# EAGLE schematic video_test (EAGLE 6.6.0)
Assembly variants: Minimal, Normal

## Sheet 1 of 4
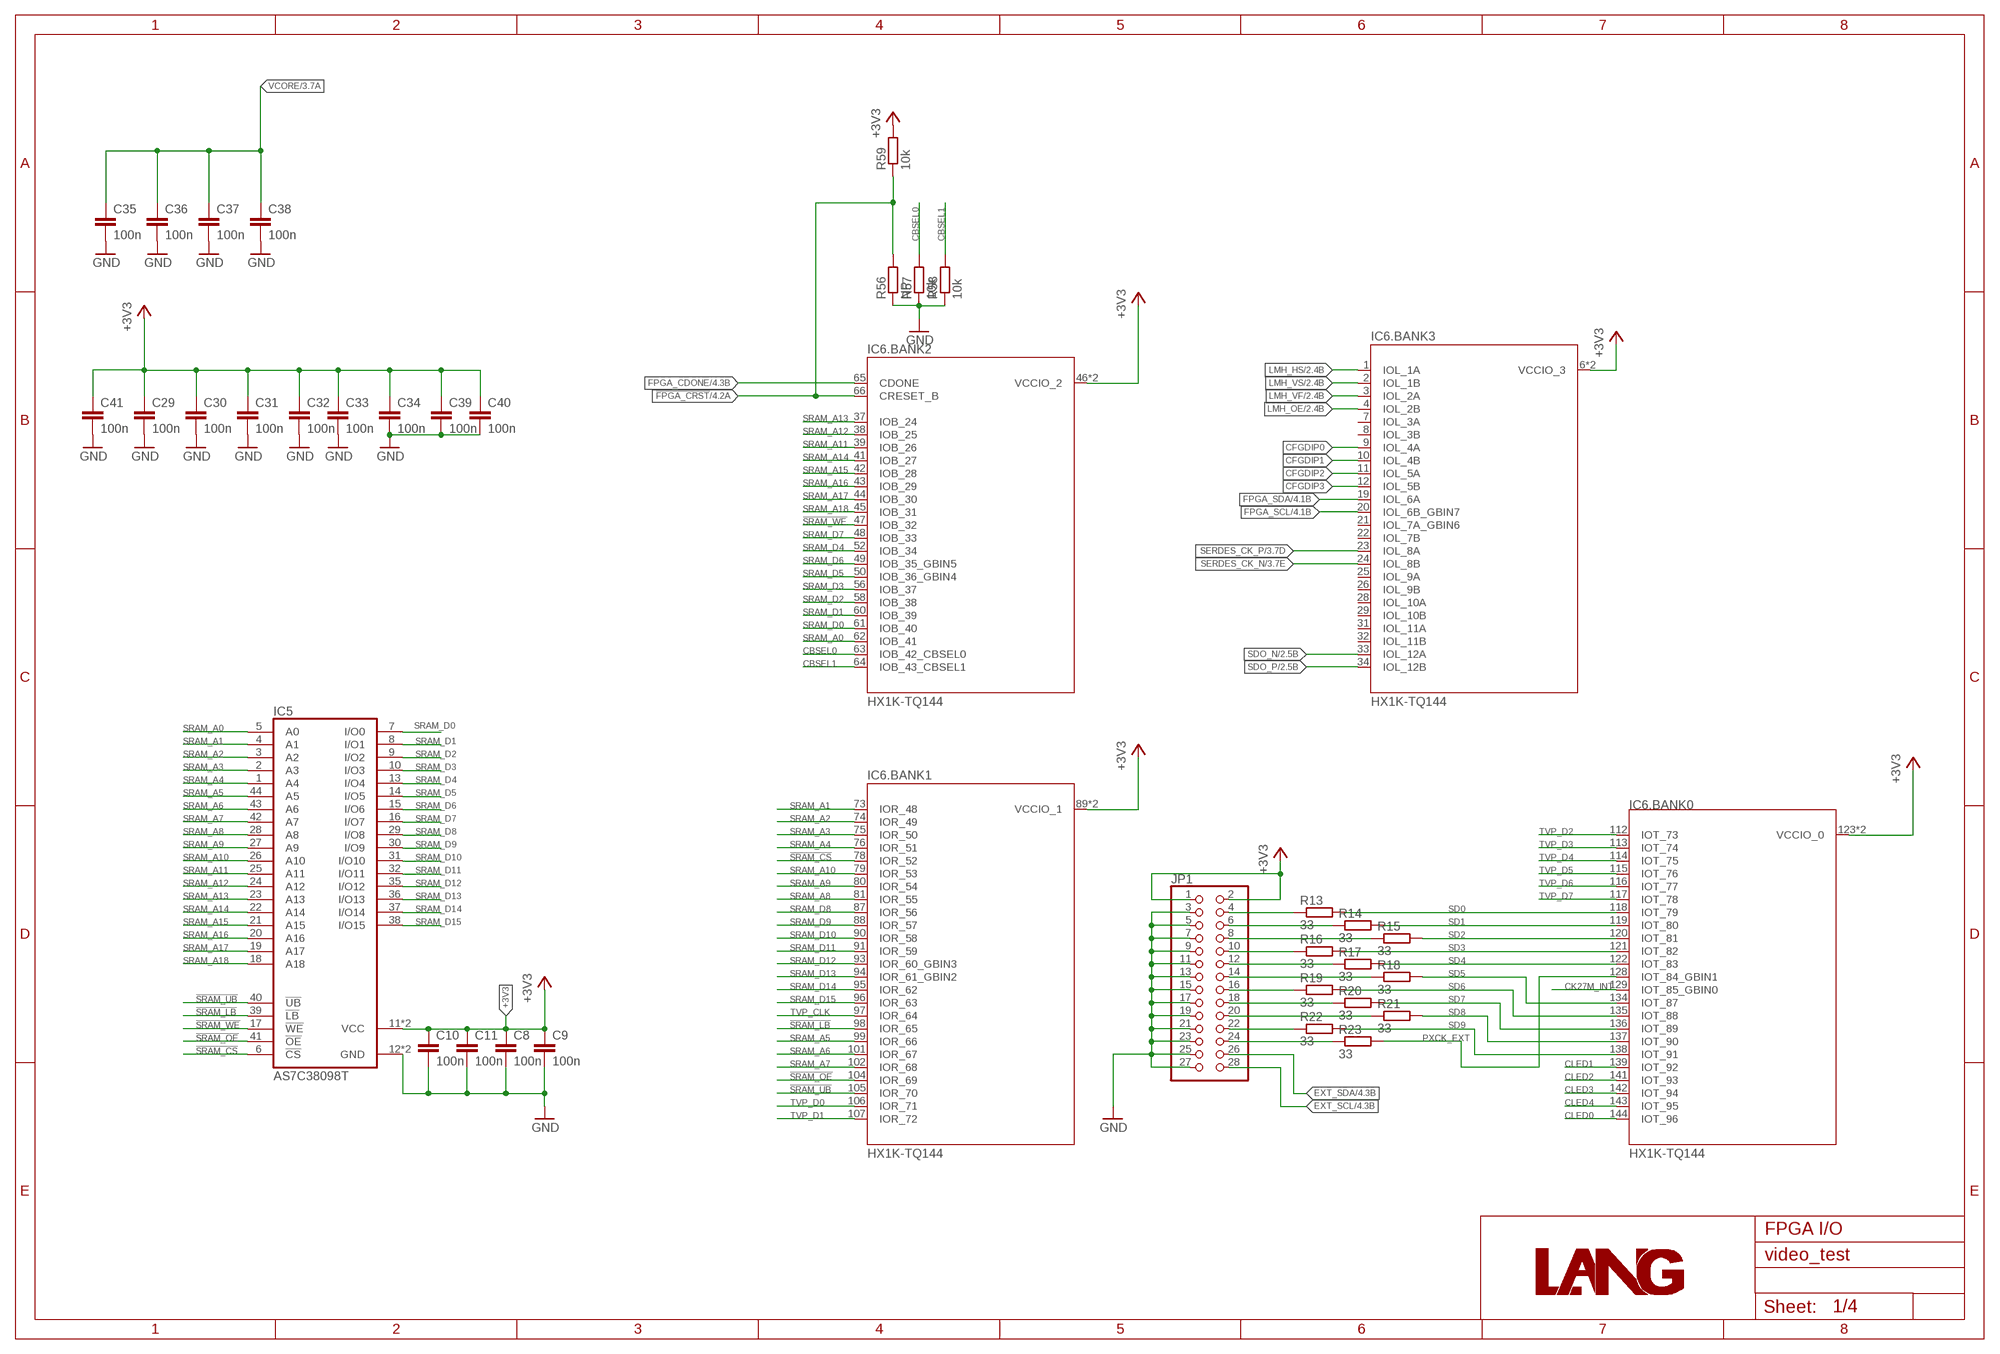
[diagram p0: schematic, sheet 1]
FRAME1 (A3L-LOC): PAGE_TITLE: FPGA I/O

### Parts
C8  100n  C-EUC0603  [C0603]  (not fitted in variant Minimal)
C9  100n  C-EUC0603  [C0603]  (not fitted in variant Minimal)
C10  100n  C-EUC0402  [C0402]  (not fitted in variant Minimal)
C11  100n  C-EUC0402  [C0402]  (not fitted in variant Minimal)
C29  100n  C-EUC0402  [C0402]
C30  100n  C-EUC0402  [C0402]
C31  100n  C-EUC0402  [C0402]
C32  100n  C-EUC0402  [C0402]
C33  100n  C-EUC0402  [C0402]
C34  100n  C-EUC0402  [C0402]
C35  100n  C-EUC0402  [C0402]
C36  100n  C-EUC0402  [C0402]
C37  100n  C-EUC0402  [C0402]
C38  100n  C-EUC0402  [C0402]
C39  100n  C-EUC0402  [C0402]
C40  100n  C-EUC0402  [C0402]
C41  100n  C-EUC0402  [C0402]
IC5  AS7C38098T  [TSOPII-Z44]  (not fitted in variant Minimal)
IC6  HX1K-TQ144  [QFP50P2200X2200X160-144N]
JP1  PINHD-2X14  [2X14]
R13  33  R-EU_R0603  [R0603]
R14  33  R-EU_R0603  [R0603]
R15  33  R-EU_R0603  [R0603]
R16  33  R-EU_R0603  [R0603]
R17  33  R-EU_R0603  [R0603]
R18  33  R-EU_R0603  [R0603]
R19  33  R-EU_R0603  [R0603]
R20  33  R-EU_R0603  [R0603]
R21  33  R-EU_R0603  [R0603]
R22  33  R-EU_R0603  [R0603]
R23  33  R-EU_R0603  [R0603]
R56  NP  R-EU_R0402  [R0402]
R57  10k  R-EU_R0402  [R0402]
R58  10k  R-EU_R0402  [R0402]
R59  10k  R-EU_R0402  [R0402]

### Nets
!FPGA_CRST!: IC6.66(.BANK2:CRESET_B) R56.2 R59.1 ; also sheet 4
!SRAM_CS!: IC5.6(!CS!) IC6.78(.BANK1:IOR_52)
!SRAM_LB!: IC5.39(!LB!) IC6.98(.BANK1:IOR_65)
!SRAM_OE!: IC5.41(!OE!) IC6.104(.BANK1:IOR_69)
!SRAM_UB!: IC5.40(!UB!) IC6.105(.BANK1:IOR_70)
!SRAM_WE!: IC5.17(!WE!) IC6.47(.BANK2:IOB_32)
+3V3: C8.1 C9.1 C10.1 C11.1 C29.1 C30.1 C31.1 C32.1 C33.1 C34.1 C39.1 C40.1 C41.1 IC5.11(VCC) IC5.33(VCC) IC6.6(.BANK3:VCCIO_3) IC6.30(.BANK3:VCCIO_3) IC6.46(.BANK2:VCCIO_2) IC6.57(.BANK2:VCCIO_2) IC6.89(.BANK1:VCCIO_1) IC6.100(.BANK1:VCCIO_1) IC6.123(.BANK0:VCCIO_0) IC6.133(.BANK0:VCCIO_0) JP1.1 JP1.2 R59.2 ; also sheet 2,3,4
CBSEL0: IC6.63(.BANK2:IOB_42_CBSEL0) R57.2 ; also sheet 4
CBSEL1: IC6.64(.BANK2:IOB_43_CBSEL1) R58.2 ; also sheet 4
CFGDIP0: IC6.9(.BANK3:IOL_4A) ; also sheet 3
CFGDIP1: IC6.10(.BANK3:IOL_4B) ; also sheet 3
CFGDIP2: IC6.11(.BANK3:IOL_5A) ; also sheet 3
CFGDIP3: IC6.12(.BANK3:IOL_5B) ; also sheet 3
CK27M_INT: IC6.129(.BANK0:IOT_85_GBIN0) ; also sheet 3
CLED0: IC6.144(.BANK0:IOT_96) ; also sheet 3
CLED1: IC6.139(.BANK0:IOT_92) ; also sheet 3
CLED2: IC6.141(.BANK0:IOT_93) ; also sheet 3
CLED3: IC6.142(.BANK0:IOT_94) ; also sheet 3
CLED4: IC6.143(.BANK0:IOT_95) ; also sheet 3
EXT_SCL: JP1.28 ; also sheet 4
EXT_SDA: JP1.26 ; also sheet 4
FPGA_CDONE: IC6.65(.BANK2:CDONE) ; also sheet 4
FPGA_SCL: IC6.20(.BANK3:IOL_6B_GBIN7) ; also sheet 4
FPGA_SDA: IC6.19(.BANK3:IOL_6A) ; also sheet 4
GND: C8.2 C9.2 C10.2 C11.2 C29.2 C30.2 C31.2 C32.2 C33.2 C34.2 C35.2 C36.2 C37.2 C38.2 C39.2 C40.2 C41.2 IC5.12(GND) IC5.34(GND) JP1.3 JP1.5 JP1.7 JP1.9 JP1.11 JP1.13 JP1.15 JP1.17 JP1.19 JP1.21 JP1.23 JP1.25 JP1.27 R56.1 R57.1 R58.1 ; also sheet 2,3,4
LMH_HS: IC6.1(.BANK3:IOL_1A) ; also sheet 2
LMH_OE: IC6.4(.BANK3:IOL_2B) ; also sheet 2
LMH_VF: IC6.3(.BANK3:IOL_2A) ; also sheet 2
LMH_VS: IC6.2(.BANK3:IOL_1B) ; also sheet 2
N$16: JP1.4 R13.1
N$17: JP1.6 R14.1
N$18: JP1.8 R15.1
N$19: JP1.10 R16.1
N$20: JP1.12 R17.1
N$21: JP1.14 R18.1
N$22: JP1.16 R19.1
N$23: JP1.18 R20.1
N$24: JP1.20 R21.1
N$25: JP1.22 R22.1
N$26: JP1.24 R23.1
PXCK_EXT: IC6.128(.BANK0:IOT_84_GBIN1) R23.2
SD0: IC6.118(.BANK0:IOT_79) R13.2
SD1: IC6.119(.BANK0:IOT_80) R14.2
SD2: IC6.120(.BANK0:IOT_81) R15.2
SD3: IC6.121(.BANK0:IOT_82) R16.2
SD4: IC6.122(.BANK0:IOT_83) R17.2
SD5: IC6.134(.BANK0:IOT_87) R18.2
SD6: IC6.135(.BANK0:IOT_88) R19.2
SD7: IC6.136(.BANK0:IOT_89) R20.2
SD8: IC6.137(.BANK0:IOT_90) R21.2
SD9: IC6.138(.BANK0:IOT_91) R22.2
SDO_N: IC6.33(.BANK3:IOL_12A) ; also sheet 2
SDO_P: IC6.34(.BANK3:IOL_12B) ; also sheet 2
SERDES_CK_N: IC6.24(.BANK3:IOL_8B) ; also sheet 3
SERDES_CK_P: IC6.23(.BANK3:IOL_8A) ; also sheet 3
SRAM_A0: IC5.5(A0) IC6.62(.BANK2:IOB_41)
SRAM_A1: IC5.4(A1) IC6.73(.BANK1:IOR_48)
SRAM_A2: IC5.3(A2) IC6.74(.BANK1:IOR_49)
SRAM_A3: IC5.2(A3) IC6.75(.BANK1:IOR_50)
SRAM_A4: IC5.1(A4) IC6.76(.BANK1:IOR_51)
SRAM_A5: IC5.44(A5) IC6.99(.BANK1:IOR_66)
SRAM_A6: IC5.43(A6) IC6.101(.BANK1:IOR_67)
SRAM_A7: IC5.42(A7) IC6.102(.BANK1:IOR_68)
SRAM_A8: IC5.28(A8) IC6.81(.BANK1:IOR_55)
SRAM_A9: IC5.27(A9) IC6.80(.BANK1:IOR_54)
SRAM_A10: IC5.26(A10) IC6.79(.BANK1:IOR_53)
SRAM_A11: IC5.25(A11) IC6.39(.BANK2:IOB_26)
SRAM_A12: IC5.24(A12) IC6.38(.BANK2:IOB_25)
SRAM_A13: IC5.23(A13) IC6.37(.BANK2:IOB_24)
SRAM_A14: IC5.22(A14) IC6.41(.BANK2:IOB_27)
SRAM_A15: IC5.21(A15) IC6.42(.BANK2:IOB_28)
SRAM_A16: IC5.20(A16) IC6.43(.BANK2:IOB_29)
SRAM_A17: IC5.19(A17) IC6.44(.BANK2:IOB_30)
SRAM_A18: IC5.18(A18) IC6.45(.BANK2:IOB_31)
SRAM_D0: IC5.7(I/O0) IC6.61(.BANK2:IOB_40)
SRAM_D1: IC5.8(I/O1) IC6.60(.BANK2:IOB_39)
SRAM_D2: IC5.9(I/O2) IC6.58(.BANK2:IOB_38)
SRAM_D3: IC5.10(I/O3) IC6.56(.BANK2:IOB_37)
SRAM_D4: IC5.13(I/O4) IC6.52(.BANK2:IOB_34)
SRAM_D5: IC5.14(I/O5) IC6.50(.BANK2:IOB_36_GBIN4)
SRAM_D6: IC5.15(I/O6) IC6.49(.BANK2:IOB_35_GBIN5)
SRAM_D7: IC5.16(I/O7) IC6.48(.BANK2:IOB_33)
SRAM_D8: IC5.29(I/O8) IC6.87(.BANK1:IOR_56)
SRAM_D9: IC5.30(I/O9) IC6.88(.BANK1:IOR_57)
SRAM_D10: IC5.31(I/O10) IC6.90(.BANK1:IOR_58)
SRAM_D11: IC5.32(I/O11) IC6.91(.BANK1:IOR_59)
SRAM_D12: IC5.35(I/O12) IC6.93(.BANK1:IOR_60_GBIN3)
SRAM_D13: IC5.36(I/O13) IC6.94(.BANK1:IOR_61_GBIN2)
SRAM_D14: IC5.37(I/O14) IC6.95(.BANK1:IOR_62)
SRAM_D15: IC5.38(I/O15) IC6.96(.BANK1:IOR_63)
TVP_CLK: IC6.97(.BANK1:IOR_64) ; also sheet 2
TVP_D0: IC6.106(.BANK1:IOR_71) ; also sheet 2
TVP_D1: IC6.107(.BANK1:IOR_72) ; also sheet 2
TVP_D2: IC6.112(.BANK0:IOT_73) ; also sheet 2
TVP_D3: IC6.113(.BANK0:IOT_74) ; also sheet 2
TVP_D4: IC6.114(.BANK0:IOT_75) ; also sheet 2
TVP_D5: IC6.115(.BANK0:IOT_76) ; also sheet 2
TVP_D6: IC6.116(.BANK0:IOT_77) ; also sheet 2
TVP_D7: IC6.117(.BANK0:IOT_78) ; also sheet 2
VCORE: C35.1 C36.1 C37.1 C38.1 ; also sheet 3,4
Unconnected: IC6.7(.BANK3:IOL_3A) IC6.8(.BANK3:IOL_3B) IC6.21(.BANK3:IOL_7A_GBIN6) IC6.22(.BANK3:IOL_7B) IC6.25(.BANK3:IOL_9A) IC6.26(.BANK3:IOL_9B) IC6.28(.BANK3:IOL_10A) IC6.29(.BANK3:IOL_10B) IC6.31(.BANK3:IOL_11A) IC6.32(.BANK3:IOL_11B)

## Sheet 2 of 4
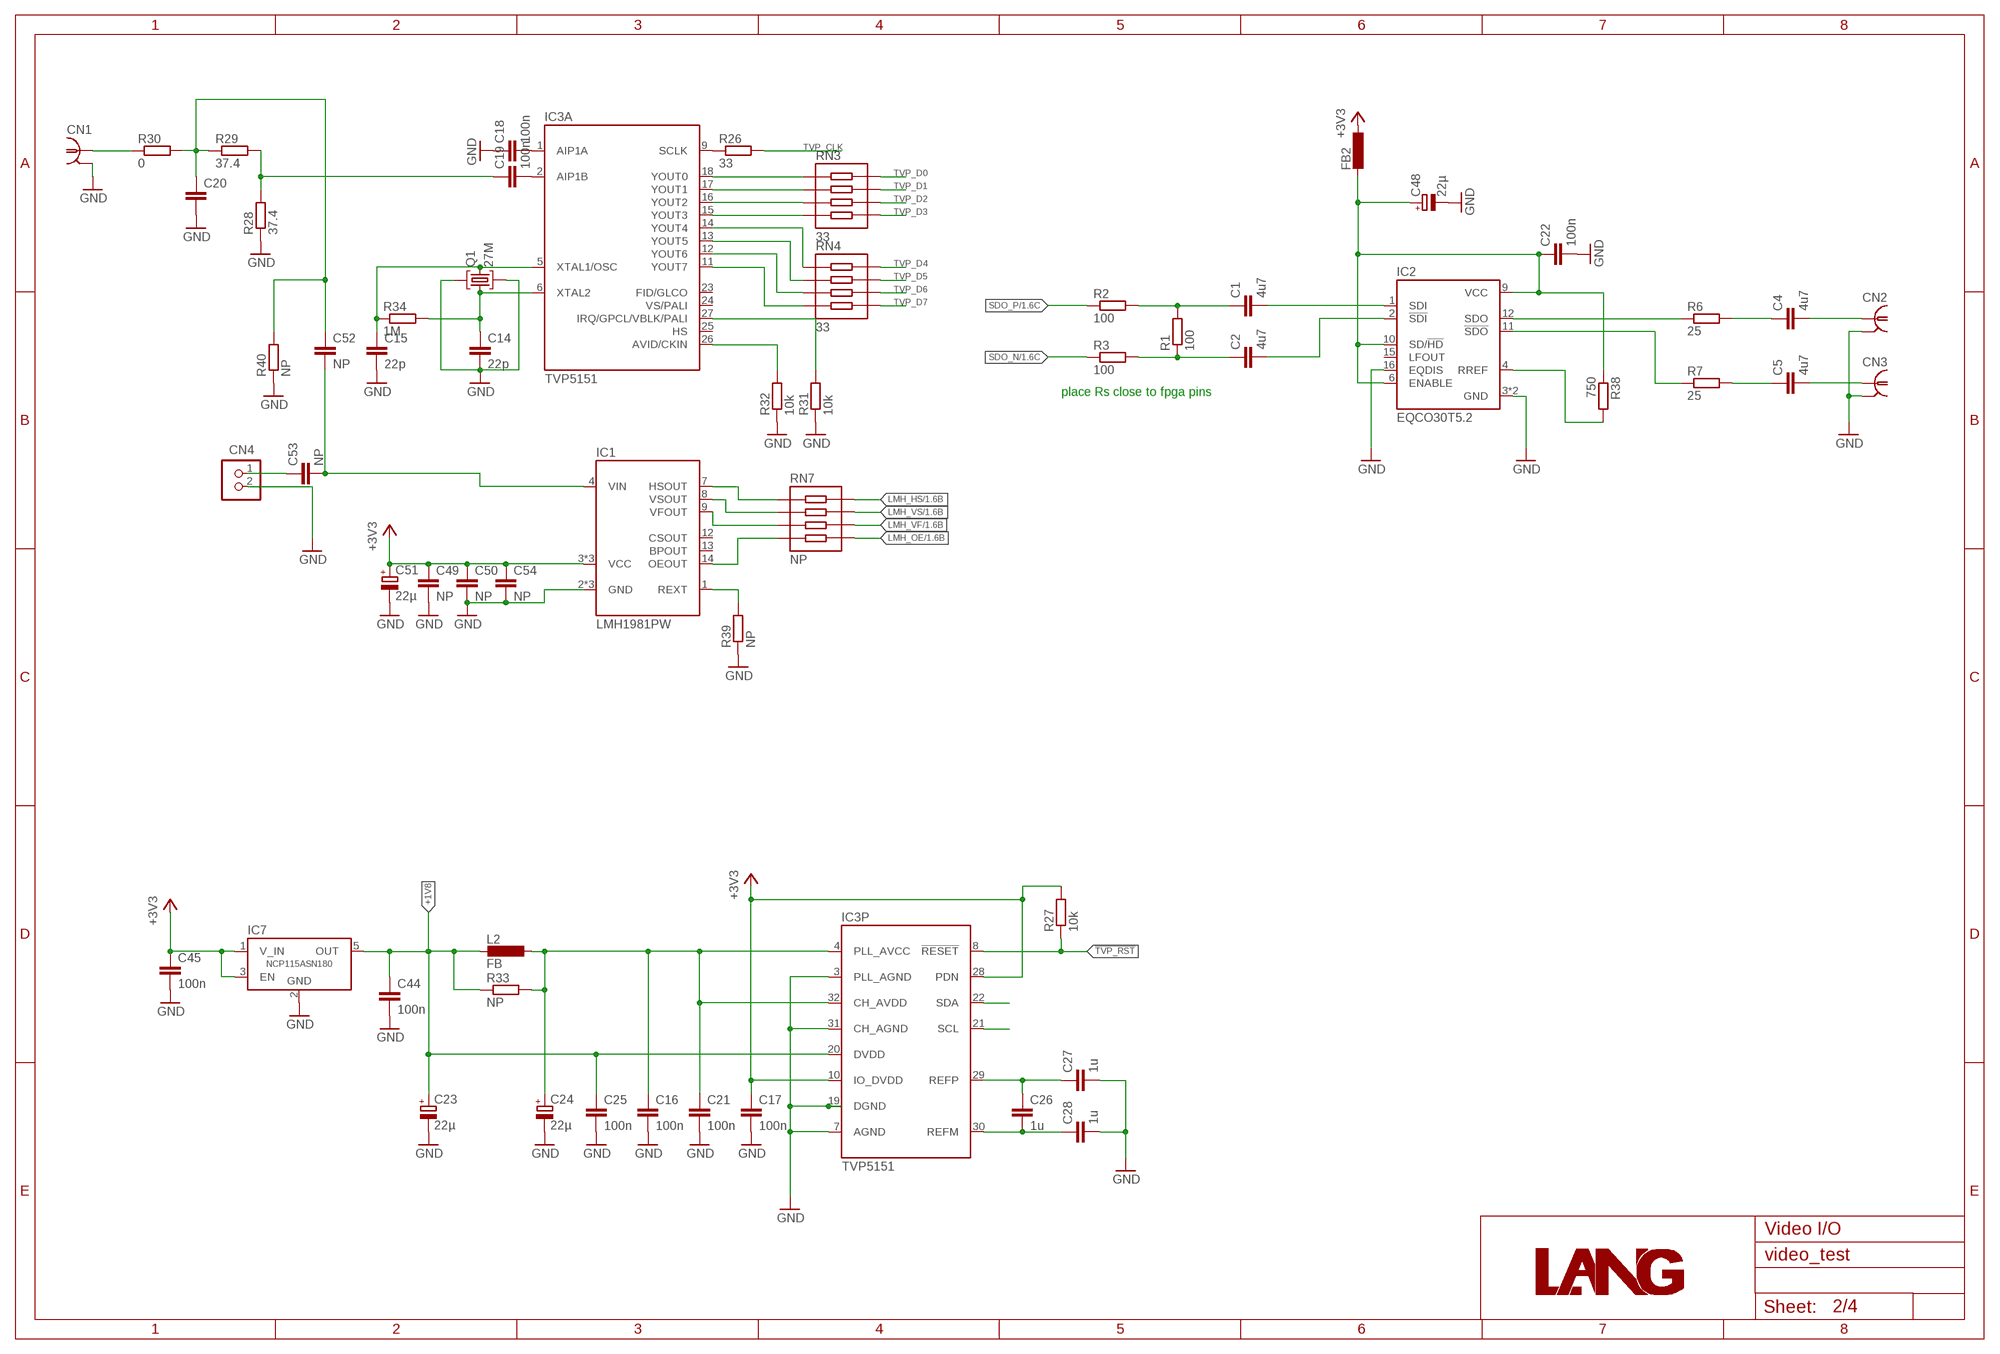
[diagram p1: schematic, sheet 2]
FRAME2 (A3L-LOC): PAGE_TITLE: Video I/O

### Parts
C1  4u7  C-EUC0603  [C0603]
C2  4u7  C-EUC0603  [C0603]
C4  4u7  C-EUC0603  [C0603]
C5  4u7  C-EUC0603  [C0603]
C14  22p  C-EUC0603  [C0603]  (not fitted in variant Minimal)
C15  22p  C-EUC0603  [C0603]  (not fitted in variant Minimal)
C16  100n  C-EUC0402  [C0402]
C17  100n  C-EUC0402  [C0402]
C18  100n  C-EUC0402  [C0402]  (not fitted in variant Minimal)
C19  100n  C-EUC0402  [C0402]  (not fitted in variant Minimal)
C20  C-EUC0603  [C0603]
C21  100n  C-EUC0402  [C0402]
C22  100n  C-EUC0402  [C0402]
C23  22µ  CPOL-EUB/3528-21R  [B/3528-21R]
C24  22µ  CPOL-EUB/3528-21R  [B/3528-21R]
C25  100n  C-EUC0402  [C0402]
C26  1u  C-EUC0603  [C0603]
C27  1u  C-EUC0603  [C0603]
C28  1u  C-EUC0603  [C0603]
C44  100n  C-EUC0603  [C0603]
C45  100n  C-EUC0603  [C0603]
C48  22µ  CPOL-EUB  [PANASONIC_B]
C49  NP  C-EUC0402  [C0402]
C50  NP  C-EUC0402  [C0402]
C51  22µ  CPOL-EUB  [PANASONIC_B]
C52  NP  C-EUC0603  [C0603]
C53  NP  C-EUC0603  [C0603]
C54  NP  C-EUC0402  [C0402]
CN1  BU-BNC-RA  [AMP_227161]  (not fitted in variant Minimal)
CN2  BU-BNC-RA  [AMP_227161]
CN3  BU-BNC-RA  [AMP_227161]
CN4  JST-XH2  [B2B-XH]
FB2  L-EU_L0603  [R0603]
IC1  LMH1981PW  [TSSOP14]  (not fitted in variant Minimal)
IC2  EQCO30T5.2  [QFN16_065]
IC3  TVP5151  [SPQFP32]  (not fitted in variant Minimal)
IC7  NCP115ASN180  [SOT23-5]
L2  FB  L-EU_L0805  [R0805]
Q1  27M  CRYSTAL_SHIELDEDMT  [MT]  (not fitted in variant Minimal)
R1  100  R-EU_R0603  [R0603]
R2  100  R-EU_R0603  [R0603]
R3  100  R-EU_R0603  [R0603]
R6  25  R-EU_R0603  [R0603]
R7  25  R-EU_R0603  [R0603]
R26  33  R-EU_R0603  [R0603]
R27  10k  R-EU_R0402  [R0402]
R28  37.4  R-EU_R0603  [R0603]
R29  37.4  R-EU_R0603  [R0603]
R30  0  R-EU_R0603  [R0603]
R31  10k  R-EU_R0402  [R0402]
R32  10k  R-EU_R0402  [R0402]
R33  NP  R-EU_R0603  [R0603]
R34  1M  R-EU_R0603  [R0603]  (not fitted in variant Minimal)
R38  750  R-EU_R0603  [R0603]
R39  NP  R-EU_R0603  [R0603]
R40  NP  R-EU_R0603  [R0603]
RN3  33  RN4-1-1206  [CTS742C083]  (not fitted in variant Minimal)
RN4  33  RN4-1-1206  [CTS742C083]  (not fitted in variant Minimal)
RN7  NP  RN4-1-1206  [CTS742C083]  (not fitted in variant Minimal)

### Nets
!TVP_RST!: IC3.8(P:!RESET!) R27.1
+1V8: C23.+ C25.1 C44.1 IC3.20(P:DVDD) IC7.5(OUT) L2.2 R33.1
+1V8_A: C16.1 C21.1 C24.+ IC3.4(P:PLL_AVCC) IC3.32(P:CH_AVDD) L2.1 R33.2
+3V3: C17.1 C45.1 C49.1 C50.1 C51.+ C54.1 FB2.1 IC1.3(VCC) IC1.6(VCC) IC1.11(VCC) IC3.10(P:IO_DVDD) IC3.28(P:PDN) IC7.1(V_IN) IC7.3(EN) R27.2 ; also sheet 1,3,4
GND: C14.2 C15.2 C16.2 C17.2 C18.1 C20.2 C21.2 C22.2 C23.- C24.- C25.2 C27.2 C28.2 C44.2 C45.2 C48.- C49.2 C50.2 C51.- C54.2 CN1.2(GND) CN2.2(GND) CN3.2(GND) CN4.2 IC1.2(GND) IC1.5(GND) IC1.10(GND) IC2.3(GND) IC2.16(EQDIS) IC2.TP(GND) IC3.3(P:PLL_AGND) IC3.7(P:AGND) IC3.19(P:DGND) IC3.31(P:CH_AGND) IC7.2(GND) Q1.2(G1) Q1.4(G2) R28.1 R31.1 R32.1 R39.1 R40.1 ; also sheet 1,3,4
LMH_HS: RN7.8(B1) ; also sheet 1
LMH_OE: RN7.5(B4) ; also sheet 1
LMH_VF: RN7.6(B3) ; also sheet 1
LMH_VS: RN7.7(B2) ; also sheet 1
N$1: C1.2 IC2.1(SDI)
N$2: C2.2 IC2.2(!SDI!)
N$3: C2.1 R1.1 R3.2
N$4: C1.1 R1.2 R2.2
N$8: C4.1 R6.2
N$9: C5.1 R7.2
N$10: C4.2 CN2.1
N$11: C5.2 CN3.1
N$30: C22.1 C48.+ FB2.2 IC2.6(ENABLE) IC2.9(VCC) IC2.10(SD/!HD!) R38.1
N$31: IC2.4(RREF) R38.2
N$36: C15.1 IC3.5(A:XTAL1/OSC) Q1.3 R34.1
N$37: C14.1 IC3.6(A:XTAL2) Q1.1 R34.2
N$38: C26.1 C27.1 IC3.29(P:REFP)
N$39: C26.2 C28.1 IC3.30(P:REFM)
N$40: C18.2 IC3.1(A:AIP1A)
N$42: IC3.11(A:YOUT7) RN4.4(A4)
N$43: IC1.7(HSOUT) RN7.1(A1)
N$44: IC3.9(A:SCLK) R26.1
N$45: IC3.12(A:YOUT6) RN4.3(A3)
N$46: IC3.13(A:YOUT5) RN4.2(A2)
N$47: IC3.14(A:YOUT4) RN4.1(A1)
N$48: IC3.15(A:YOUT3) RN3.4(A4)
N$49: IC3.16(A:YOUT2) RN3.3(A3)
N$50: IC3.17(A:YOUT1) RN3.2(A2)
N$51: IC3.18(A:YOUT0) RN3.1(A1)
N$53: C19.2 IC3.2(A:AIP1B)
N$54: IC3.27(A:IRQ/GPCL/VBLK/PALI) R31.2
N$55: C19.1 R28.2 R29.2
N$56: C20.1 C52.1 R29.1 R30.2 R40.2
N$57: CN1.1 R30.1
N$58: IC3.26(A:AVID/CKIN) R32.2
N$59: C52.2 C53.2 IC1.4(VIN)
N$61: C53.1 CN4.1
N$62: IC1.8(VSOUT) RN7.2(A2)
N$63: IC1.1(REXT) R39.2
N$64: IC1.9(VFOUT) RN7.3(A3)
N$65: IC1.14(OEOUT) RN7.4(A4)
SCL: IC3.21(P:SCL) ; also sheet 4
SDA: IC3.22(P:SDA) ; also sheet 4
SDI_OUT_N: IC2.11(!SDO!) R7.1
SDI_OUT_P: IC2.12(SDO) R6.1
SDO_N: R3.1 ; also sheet 1
SDO_P: R2.1 ; also sheet 1
TVP_CLK: R26.2 ; also sheet 1
TVP_D0: RN3.8(B1) ; also sheet 1
TVP_D1: RN3.7(B2) ; also sheet 1
TVP_D2: RN3.6(B3) ; also sheet 1
TVP_D3: RN3.5(B4) ; also sheet 1
TVP_D4: RN4.8(B1) ; also sheet 1
TVP_D5: RN4.7(B2) ; also sheet 1
TVP_D6: RN4.6(B3) ; also sheet 1
TVP_D7: RN4.5(B4) ; also sheet 1
Unconnected: IC1.12(CSOUT) IC1.13(BPOUT) IC2.15(LFOUT) IC3.23(A:FID/GLCO) IC3.24(A:VS/PALI) IC3.25(A:HS)

### Notes on the sheet
- place Rs close to fpga pins

## Sheet 3 of 4
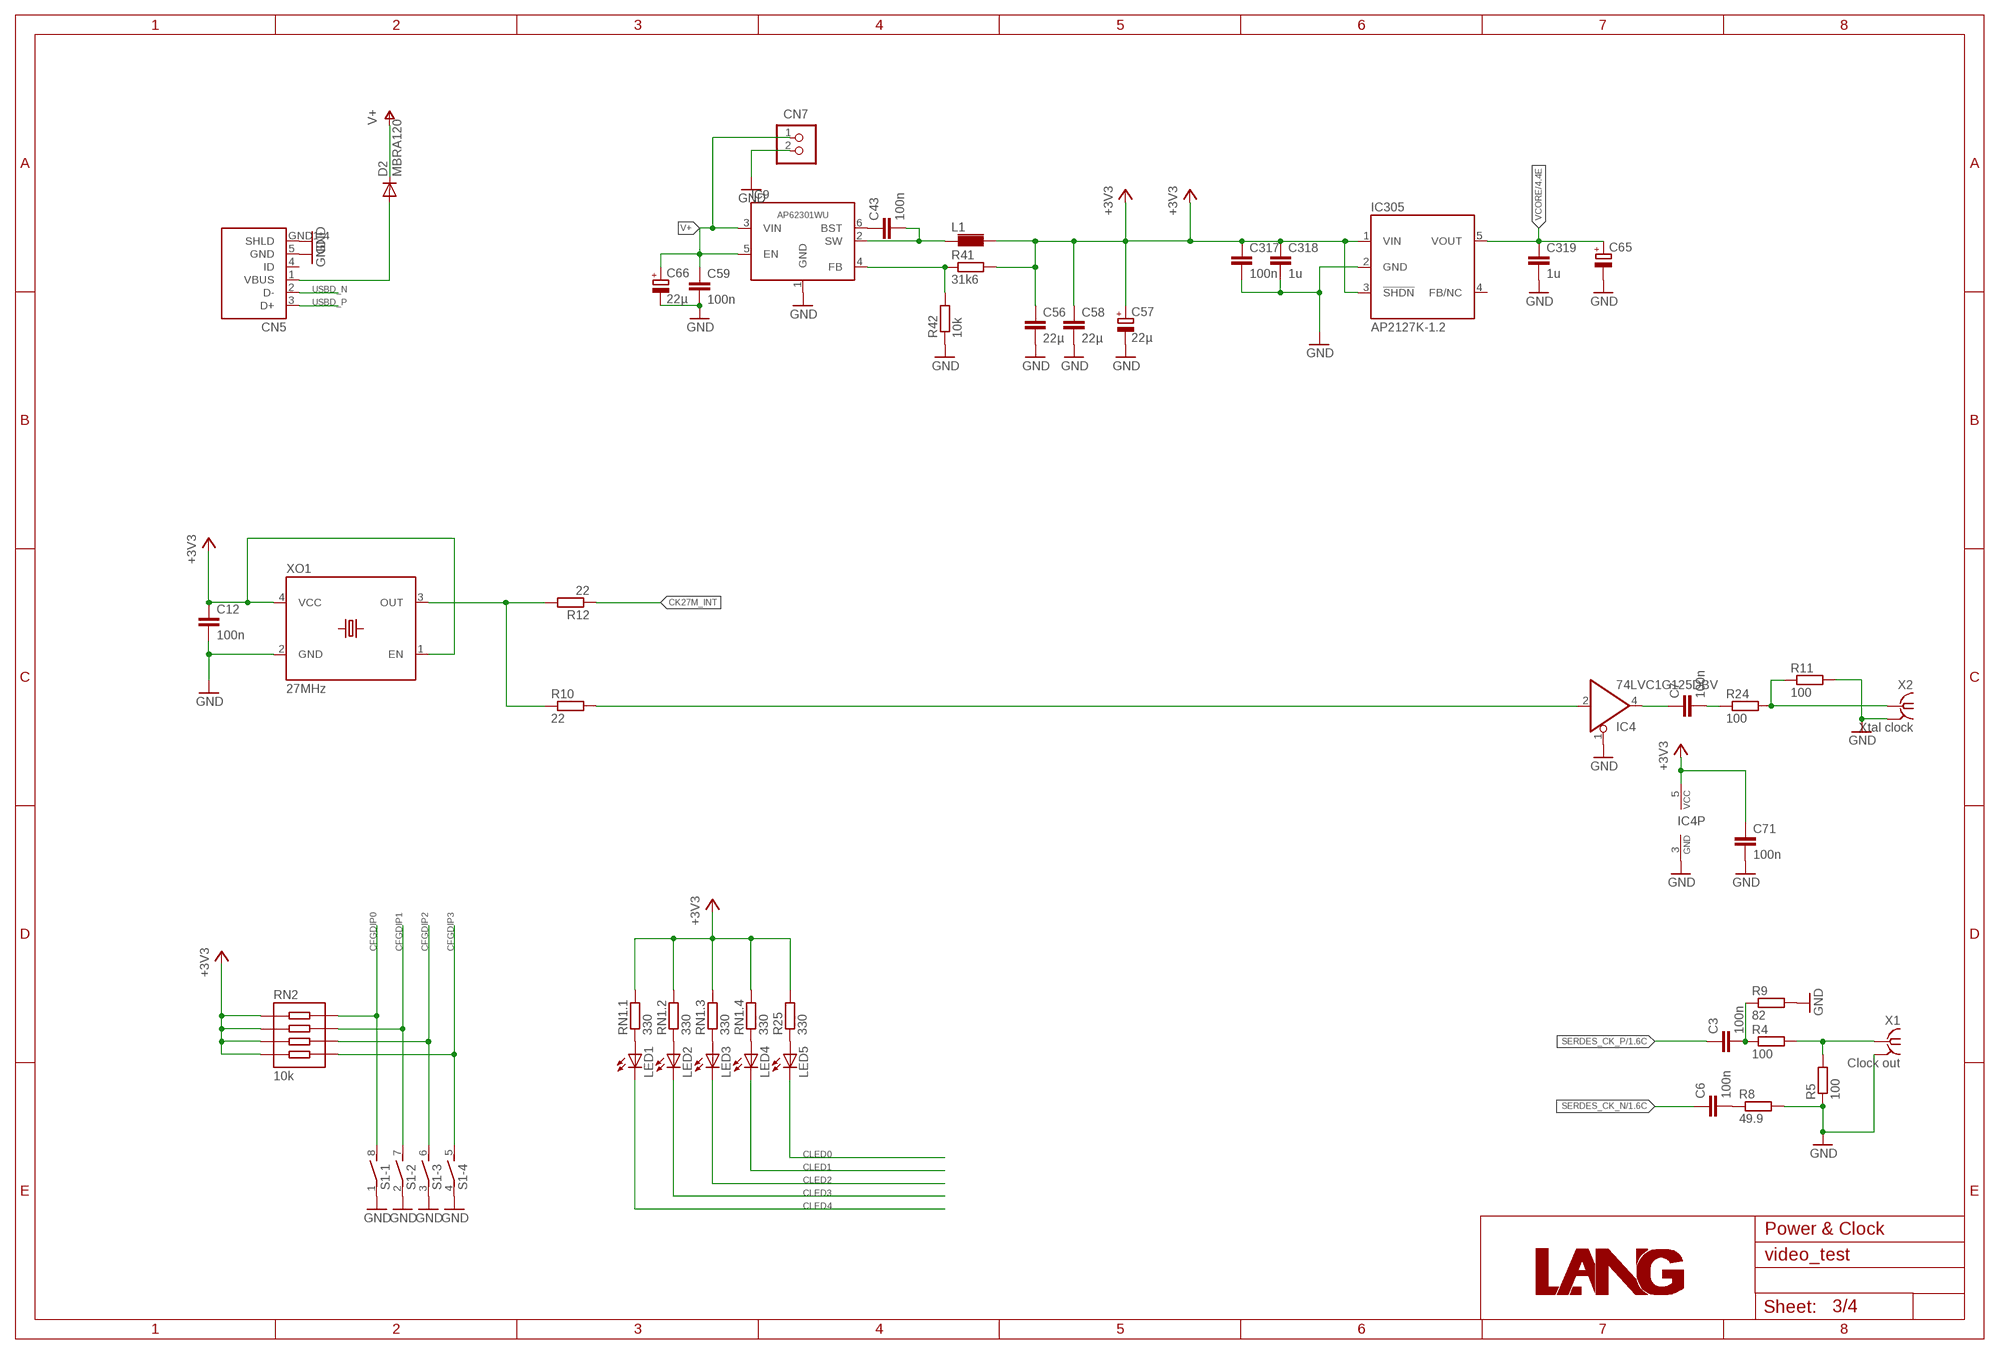
[diagram p2: schematic, sheet 3]
FRAME4 (A3L-LOC): PAGE_TITLE: Power & Clock

### Parts
C3  100n  C-EUC0603  [C0603]
C6  100n  C-EUC0603  [C0603]
C7  100n  C-EUC0603  [C0603]
C12  100n  C-EUC0603  [C0603]
C43  100n  C-EUC0603  [C0603]
C56  22µ  C-EUC0805  [C0805]
C57  22µ  CPOL-EUB  [PANASONIC_B]
C58  22µ  C-EUC0805  [C0805]
C59  100n  C-EUC0603  [C0603]
C65  CPOL-EUB/3528-21R  [B/3528-21R]
C66  22µ  CPOL-EUC  [PANASONIC_C]
C71  100n  C-EUC0603  [C0603]
C317  100n  C-EUC0603  [C0603]
C318  1u  C-EUC0603  [C0603]
C319  1u  C-EUC0603  [C0603]
CN5  USB-UJ2-MIBH-G  [UJ2-MIBH-G-SMT]
CN7  JST-XH2  [B2B-XH]
D2  MBRA120  [SMA]
IC4  74LVC1G125DBV  [SOT23-5]  (not fitted in variant Minimal)
IC9  AP62301WU  [SOT23-6L]
IC305  AP2127K-1.2  [SOT23-5]
L1  L-TYA4020  [TYA4020]
LED1  LEDCHIP-LED0603  [CHIP-LED0603]
LED2  LEDCHIP-LED0603  [CHIP-LED0603]
LED3  LEDCHIP-LED0603  [CHIP-LED0603]
LED4  LEDCHIP-LED0603  [CHIP-LED0603]
LED5  LEDCHIP-LED0603  [CHIP-LED0603]
R4  100  R-EU_R0603  [R0603]
R5  100  R-EU_R0603  [R0603]
R8  49.9  R-EU_R0603  [R0603]
R9  82  R-EU_R0603  [R0603]
R10  22  R-EU_R0603  [R0603]
R11  100  R-EU_R0603  [R0603]
R12  22  R-EU_R0603  [R0603]
R24  100  R-EU_R0603  [R0603]
R25  330  R-EU_R0603  [R0603]
R41  31k6  R-EU_R0603  [R0603]
R42  10k  R-EU_R0603  [R0603]
RN1  330  RN4-1206  [CTS742C083]
RN2  10k  RN4-1-1206  [CTS742C083]
S1  DIP04S  [DIP04S]  (not fitted in variant Minimal)
X1  Clock out  BU-SMA-V  [BU-SMA-V]  (not fitted in variant Minimal)
X2  Xtal clock  BU-SMA-V  [BU-SMA-V]  (not fitted in variant Minimal)
XO1  27MHz  XO-SMD  [ECS-2333]

### Nets
+3V3: C12.1 C56.1 C57.+ C58.1 C71.1 C317.1 C318.1 IC4.5(VCC) IC305.1(VIN) IC305.3(!SHDN!) L1.2 R25.2 R41.2 RN1.5 RN1.6 RN1.7 RN1.8 RN2.1(A1) RN2.2(A2) RN2.3(A3) RN2.4(A4) XO1.1(EN) XO1.4(VCC) ; also sheet 1,2,4
CFGDIP0: RN2.8(B1) S1.8 ; also sheet 1
CFGDIP1: RN2.7(B2) S1.7 ; also sheet 1
CFGDIP2: RN2.6(B3) S1.6 ; also sheet 1
CFGDIP3: RN2.5(B4) S1.5 ; also sheet 1
CK27M_INT: R12.1 ; also sheet 1
CLED0: LED5.C ; also sheet 1
CLED1: LED4.C ; also sheet 1
CLED2: LED3.C ; also sheet 1
CLED3: LED2.C ; also sheet 1
CLED4: LED1.C ; also sheet 1
GND: C12.2 C56.2 C57.- C58.2 C59.2 C65.- C66.- C71.2 C317.2 C318.2 C319.2 CN5.5(GND) CN5.GND1(SHLD) CN5.GND2(SHLD) CN5.GND3(SHLD) CN5.GND4(SHLD) CN7.2 IC4.1(OE) IC4.3(GND) IC9.1(GND) IC305.2(GND) R5.1 R8.2 R9.2 R11.2 R42.1 S1.1 S1.2 S1.3 S1.4 X1.2(GND) X2.2(GND) XO1.2(GND) ; also sheet 1,2,4
N$5: R4.2 R5.2 X1.1
N$6: C6.2 R8.1
N$7: C3.2 R4.1 R9.1
N$12: R11.1 R24.2 X2.1
N$13: IC4.2(I) R10.2
N$14: R10.1 R12.2 XO1.3(OUT)
N$15: C7.1 IC4.4(O)
N$27: C7.2 R24.1
N$28: C43.2 IC9.2(SW) L1.1
N$32: LED1.A RN1.1
N$33: LED2.A RN1.2
N$34: LED3.A RN1.3
N$35: LED4.A RN1.4
N$41: LED5.A R25.1
N$52: C43.1 IC9.6(BST)
N$67: IC9.4(FB) R41.1 R42.2
N$70: CN5.1(VBUS) D2.A
SERDES_CK_N: C6.1 ; also sheet 1
SERDES_CK_P: C3.1 ; also sheet 1
USBD_N [100r]: CN5.2(D-) ; also sheet 4
USBD_P [100r]: CN5.3(D+) ; also sheet 4
V+: C59.1 C66.+ CN7.1 D2.C IC9.3(VIN) IC9.5(EN)
VCORE: C65.+ C319.1 IC305.5(VOUT) ; also sheet 1,4
Unconnected: CN5.4(ID) IC305.4(FB/NC)

## Sheet 4 of 4
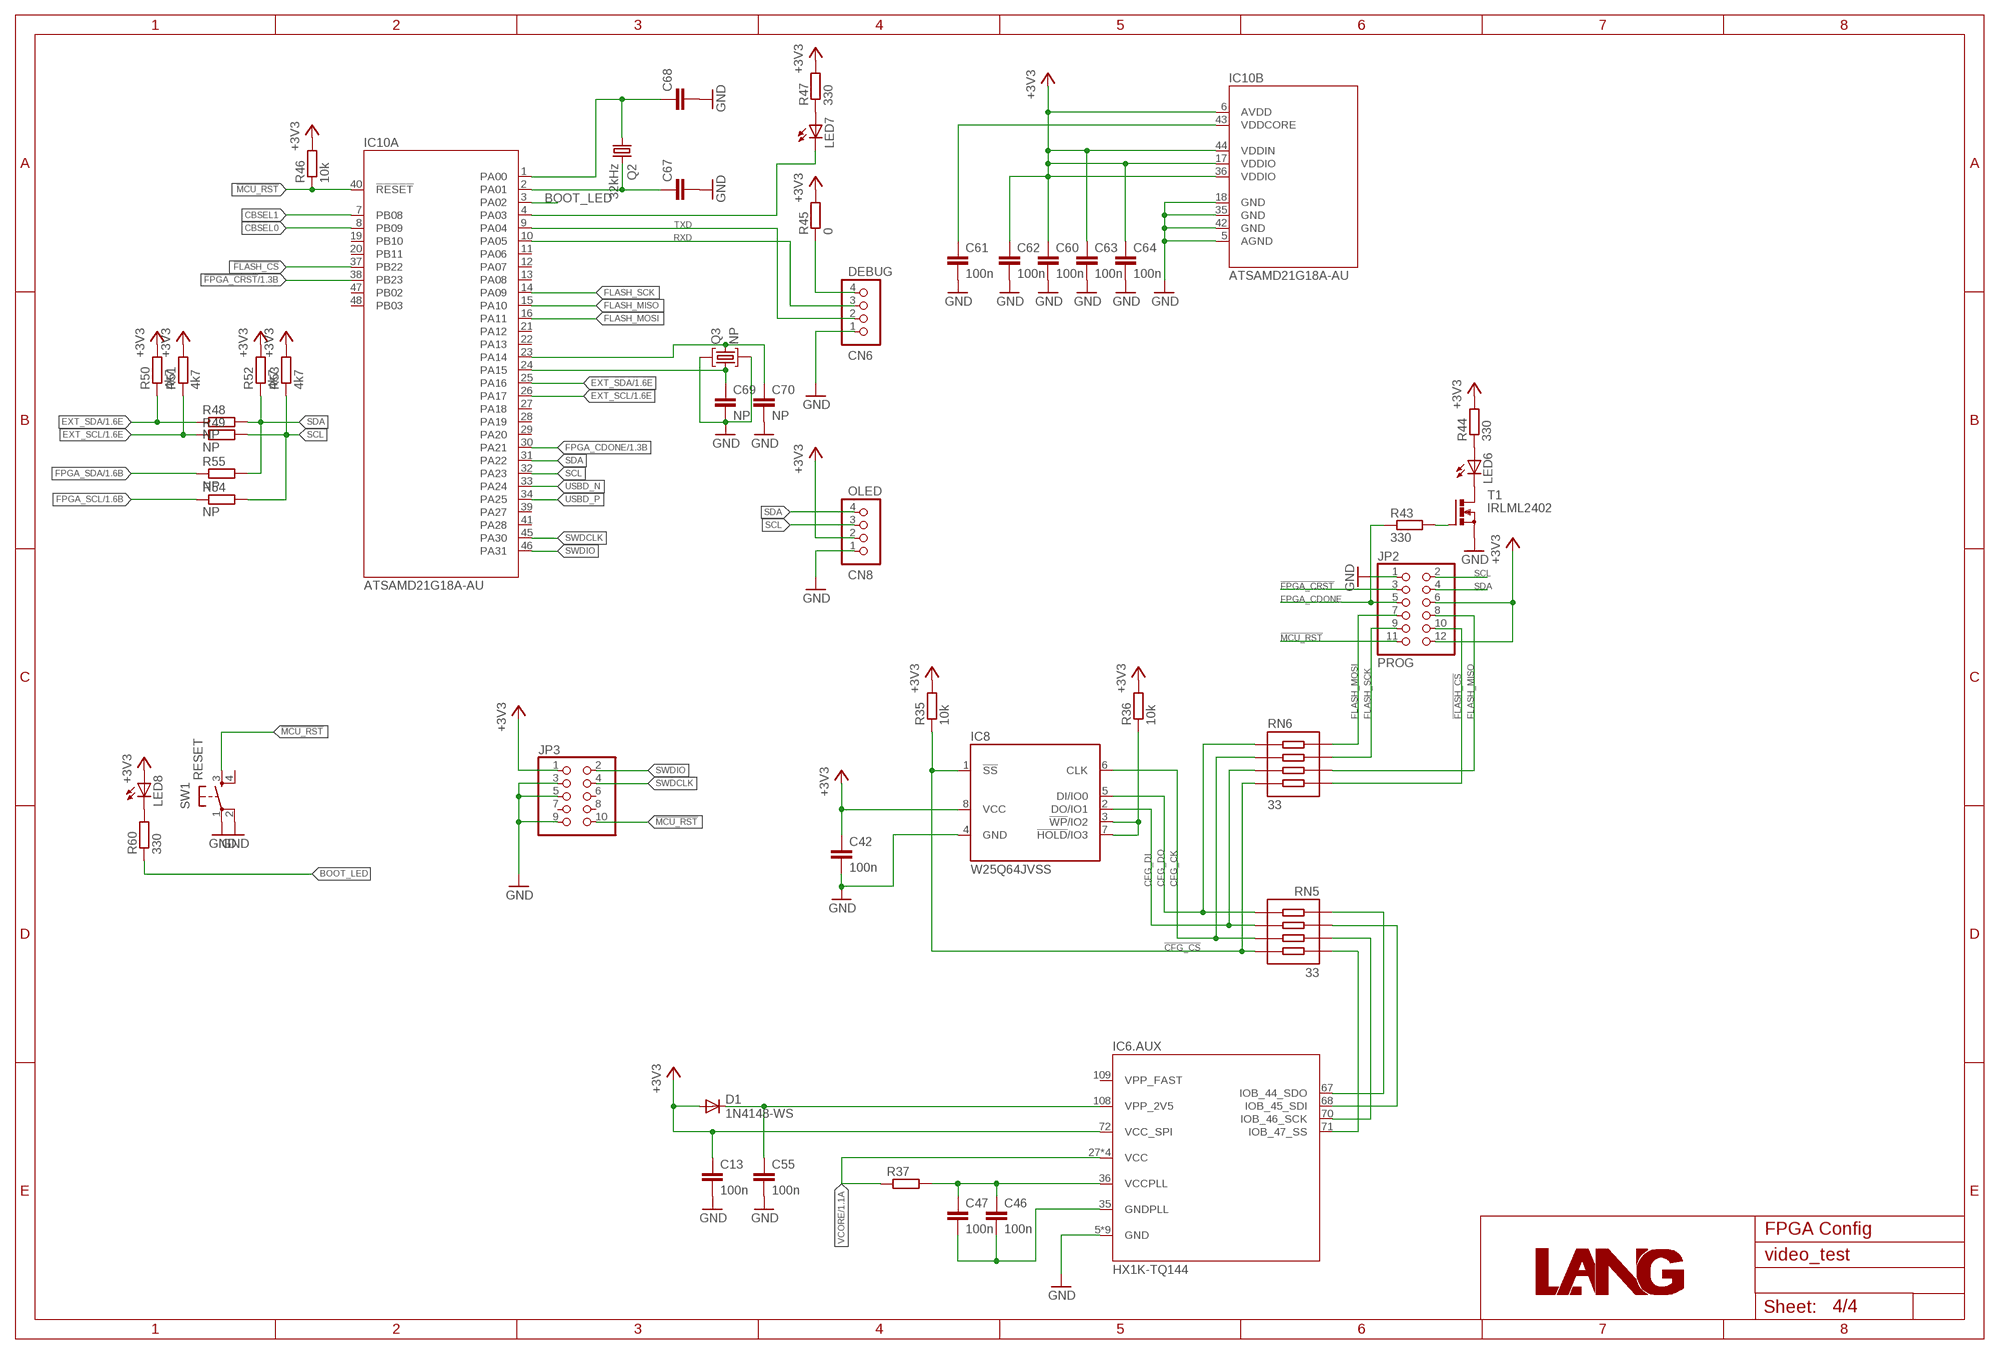
[diagram p3: schematic, sheet 4]
FRAME3 (A3L-LOC): PAGE_TITLE: FPGA Config

### Parts
C13  100n  C-EUC0402  [C0402]
C42  100n  C-EUC0603  [C0603]
C46  100n  C-EUC0402  [C0402]
C47  100n  C-EUC0603  [C0603]
C55  100n  C-EUC0402  [C0402]
C60  100n  C-EUC0402  [C0402]
C61  100n  C-EUC0402  [C0402]
C62  100n  C-EUC0402  [C0402]
C63  100n  C-EUC0402  [C0402]
C64  100n  C-EUC0402  [C0402]
C67  C-EUC0402  [C0402]
C68  C-EUC0402  [C0402]
C69  NP  C-EUC0603  [C0603]
C70  NP  C-EUC0603  [C0603]
CN6  DEBUG  PINHD-1X4-RH  [SL-254-RH-4]
CN8  OLED  PINHD-1X4-RH  [SL-254-RH-4]  (not fitted in variant Minimal)
D1  1N4148-WS  [SOD323]
IC8  W25Q64JVSS  [SO-08M]
IC10  ATSAMD21G18A-AU  [TQFP48_7X7MC_MCH]
JP2  PROG  PINHD-2X6  [2X06]
JP3  PINHD-2X5-127  [SL127-2X5]
LED6  LEDCHIP-LED0603  [CHIP-LED0603]
LED7  LEDCHIP-LED0603  [CHIP-LED0603]
LED8  LEDCHIP-LED0603  [CHIP-LED0603]
Q2  32kHz  CRYSTAL-IQXC-25  [IQXC-25]
Q3  NP  CRYSTAL_SHIELDEDMT  [MT]  (not fitted in variant Minimal)
R35  10k  R-EU_R0603  [R0603]
R36  10k  R-EU_R0603  [R0603]
R37  R-EU_R0603  [R0603]
R43  330  R-EU_R0603  [R0603]
R44  330  R-EU_R0603  [R0603]
R45  0  R-EU_R0603  [R0603]
R46  10k  R-EU_R0603  [R0603]
R47  330  R-EU_R0603  [R0603]
R48  NP  R-EU_R0603  [R0603]
R49  NP  R-EU_R0603  [R0603]
R50  4k7  R-EU_R0603  [R0603]
R51  4k7  R-EU_R0603  [R0603]
R52  4k7  R-EU_R0603  [R0603]
R53  4k7  R-EU_R0603  [R0603]
R54  NP  R-EU_R0402  [R0402]
R55  NP  R-EU_R0402  [R0402]
R60  330  R-EU_R0603  [R0603]
RN5  33  RN4-1-1206  [CTS742C083]
RN6  33  RN4-1-1206  [CTS742C083]
SW1  RESET  PTS526-SM15  [PTS526]
T1  IRLML2402  [SOT23]

### Nets
!CFG_CS!: IC8.1(!SS!) R35.1 RN5.5(B4) RN6.4(A4)
!FLASH_CS!: IC10.37(A:PB22) JP2.10 RN6.5(B4)
!FPGA_CRST!: IC10.38(A:PB23) JP2.3 ; also sheet 1
!MCU_RST!: IC10.40(A:!RESET) JP2.11 JP3.10 R46.1 SW1.3(S)
+3V3: C13.1 C42.1 C60.1 C62.1 C63.1 C64.1 CN8.2 D1.A IC6.72(.AUX:VCC_SPI) IC8.8(VCC) IC10.6(B:AVDD) IC10.17(B:VDDIO) IC10.36(B:VDDIO) IC10.44(B:VDDIN) JP2.6 JP2.12 JP3.1 LED8.A R35.2 R36.2 R44.2 R45.2 R46.2 R47.2 R50.2 R51.2 R52.2 R53.2 ; also sheet 1,2,3
BOOT_LED: IC10.3(A:PA02) R60.1
CBSEL0: IC10.8(A:PB09) ; also sheet 1
CBSEL1: IC10.7(A:PB08) ; also sheet 1
CFG_CK: IC8.6(CLK) RN5.6(B3) RN6.2(A2)
CFG_DI: IC8.2(DO/IO1) RN5.7(B2) RN6.3(A3)
CFG_DO: IC8.5(DI/IO0) RN5.8(B1) RN6.1(A1)
EXT_SCL: IC10.26(A:PA17) R49.1 R51.1 ; also sheet 1
EXT_SDA: IC10.25(A:PA16) R48.1 R50.1 ; also sheet 1
FLASH_MISO: IC10.15(A:PA10) JP2.8 RN6.6(B3)
FLASH_MOSI: IC10.16(A:PA11) JP2.7 RN6.8(B1)
FLASH_SCK: IC10.14(A:PA09) JP2.9 RN6.7(B2)
FPGA_CDONE: IC10.30(A:PA21) JP2.5 R43.1 ; also sheet 1
FPGA_CS: IC6.71(.AUX:IOB_47_SS) RN5.4(A4)
FPGA_SCK: IC6.70(.AUX:IOB_46_SCK) RN5.3(A3)
FPGA_SCL: R54.1 ; also sheet 1
FPGA_SDA: R55.1 ; also sheet 1
FPGA_SDI: IC6.68(.AUX:IOB_45_SDI) RN5.2(A2)
FPGA_SDO: IC6.67(.AUX:IOB_44_SDO) RN5.1(A1)
GND: C13.2 C42.2 C55.2 C60.2 C61.2 C62.2 C63.2 C64.2 C67.2 C68.2 C69.2 C70.2 CN6.1 CN8.1 IC6.5(.AUX:GND) IC6.13(.AUX:GND) IC6.14(.AUX:GND) IC6.59(.AUX:GND) IC6.69(.AUX:GND) IC6.86(.AUX:GND) IC6.103(.AUX:GND) IC6.132(.AUX:GND) IC6.140(.AUX:GND) IC8.4(GND) IC10.5(B:AGND) IC10.18(B:GND) IC10.35(B:GND) IC10.42(B:GND) JP2.1 JP3.3 JP3.5 JP3.9 Q3.2(G1) Q3.4(G2) SW1.1(P) SW1.2(P1) T1.2(S) ; also sheet 1,2,3
GNDPLL: C46.2 C47.2 IC6.35(.AUX:GNDPLL)
N$29: C55.1 D1.K(C) IC6.108(.AUX:VPP_2V5)
N$60: IC8.3(!WP!/IO2) IC8.7(!HOLD!/IO3) R36.1
N$66: LED6.C T1.3(D)
N$68: R43.2 T1.1(G)
N$69: LED6.A R44.1
N$71: C67.1 IC10.2(A:PA01) Q2.2
N$72: C61.1 IC10.43(B:VDDCORE)
N$74: CN6.4 R45.1
N$75: C68.1 IC10.1(A:PA00) Q2.1
N$76: C69.1 IC10.24(A:PA15) Q3.1
N$77: C70.1 IC10.23(A:PA14) Q3.3
N$78: LED7.A R47.1
N$79: IC10.4(A:PA03) LED7.C
N$81: LED8.C R60.2
RXD: CN6.3 IC10.10(A:PA05)
SCL: CN8.3 IC10.32(A:PA23) JP2.2 R49.2 R53.1 R54.2 ; also sheet 2
SDA: CN8.4 IC10.31(A:PA22) JP2.4 R48.2 R52.1 R55.2 ; also sheet 2
SWDCLK: IC10.45(A:PA30) JP3.4
SWDIO: IC10.46(A:PA31) JP3.2
TXD: CN6.2 IC10.9(A:PA04)
USBD_N [100r]: IC10.33(A:PA24) ; also sheet 3
USBD_P [100r]: IC10.34(A:PA25) ; also sheet 3
VCCPLL: C46.1 C47.1 IC6.36(.AUX:VCCPLL) R37.2
VCORE: IC6.27(.AUX:VCC) IC6.51(.AUX:VCC) IC6.92(.AUX:VCC) IC6.111(.AUX:VCC) R37.1 ; also sheet 1,3
Unconnected: IC10.11(A:PA06) IC10.12(A:PA07) IC10.13(A:PA08) IC10.19(A:PB10) IC10.20(A:PB11) IC10.21(A:PA12) IC10.22(A:PA13) IC10.27(A:PA18) IC10.28(A:PA19) IC10.29(A:PA20) IC10.39(A:PA27) IC10.41(A:PA28) IC10.47(A:PB02) IC10.48(A:PB03) JP3.6 JP3.7 JP3.8 SW1.4(S1)

## Power pins joined to a net without a drawn wire
GND: X1.3(GND) X1.4(GND) X1.5(GND) X2.3(GND) X2.4(GND) X2.5(GND)
VPP_FAST: IC6.109(.AUX:VPP_FAST)

## Library data of the parts
C1-C22 C25-C47 C49 C50 C52-C56 C58-C64 C67-C71 C317-C319 = rcl:C-EU: CAPACITOR, European symbol
C23 C24 C48 C51 C57 C65 C66 = rcl:CPOL-EU: POLARIZED CAPACITOR, European symbol
CN1-CN3 = mycon:BU-BNC: JACK, RIGHT ANGLE, 50 OHM, PCB, BNC Source: amp_227161.pdf
CN4 CN7 = mycon:JST-XH2
CN5 = myusb:USB: USB Connectors
CN6 CN8 = mycon:PINHD-1X4
D1 = dioden:1N4148: DIODE high speed (Philips)
D2 = dioden:MBRA120
FB2 L2 = mylcr:L-EU
IC1 = video:LMH1981
IC2 = video:EQCO30T5.2
IC3 = video:TVP5151
IC4 = 74xx-little-de:74*1G125: Single Bus Buffer Gate with 3-State Output
IC5 = myram:AS7C38098
IC6 = lattice-ice40:HX1K-TQ144
IC7 = myvreg:NCP115ASN
IC8 = myram:W25Q
IC9 = schaltregler:AP62301
IC10 = my_atmel:ATSAMD21G18A-AU; BUILT_BY: EMA_Molly; COPYRIGHT: Copyright (C) 2018 Accelerated Designs. All rights reserved; MANUFACTURER_PART_NUMBER: ATSAMD21G18A-AU; SOURCELIBRARY: Microchip_2019-08-23_25; VENDOR: Microchip
IC305 = myvreg:AP2127K
JP1 = pinhead:PINHD-2X14: PIN HEADER
JP2 = pinhead:PINHD-2X6: PIN HEADER
JP3 = mycon:PINHD-2X5: PIN HEADER
L1 = myinductors:L
LED1-LED8 = led:LED: LED OSRAM: - CHIPLED LG R971, LG N971, LY N971, LG Q971, LY Q971, LO R971, LY R971 LH N974, LH R974 LS Q976, LO Q976, LY Q976 LO Q996 - Hyper CHIPLED LW Q18S LB Q993, LB Q99A, LB R99A - SideLED LS A670, LO A670, LY A670, LG A670, LP A670 LB A673, LV A673, LT A673, LW A673 LH A674 LY A675 LS A676, LA A676, LO A676, LY A676, LW A676 LS A679, LY A679, LG A679 - Hyper Micro SIDELED® LS Y876, LA Y876, LO Y876, LY Y876 LT Y87S - SmartLED LW L88C, LW L88S LB L89C, LB L89S, LG L890 LS L89K, LO L89K, LY L89K LS L896, LA L896, LO L896, LY L896 - TOPLED LS T670, LO T670, LY T670, LG T670, LP T670 LSG T670, LSP T670, LSY T670, LOP T670, LYG T670 LG T671, LOG T671, LSG T671 LB T673, LV T673, LT T673, LW T673 LH T674 LS T676, LA T676, LO T676, LY T676, LB T676, LH T676, LSB T676, LW T676 LB T67C, LV T67C, LT T67C, LS T67K, LO T67K, LY T67K, LW E67C LS E67B, LA E67B, LO E67B, LY E67B, LB E67C, LV E67C, LT E67C LW T67C LS T679, LY T679, LG T679 LS T770, LO T770, LY T770, LG T770, LP T770 LB T773, LV T773, LT T773, LW T773 LH T774 LS E675, LA E675, LY E675, LS T675 LS T776, LA T776, LO T776, LY T776, LB T776 LHGB T686 LT T68C, LB T68C - Hyper Mini TOPLED® LB M676 - Mini TOPLED Santana® LG M470 LS M47K, LO M47K, LY M47K Source: http://www.osram.convergy.de LUXEON: - LUMILED® LXK2-PW12-R00, LXK2-PW12-S00, LXK2-PW14-U00, LXK2-PW14-V00 LXK2-PM12-R00, LXK2-PM12-S00, LXK2-PM14-U00 LXK2-PE12-Q00, LXK2-PE12-R00, LXK2-PE12-S00, LXK2-PE14-T00, LXK2-PE14-U00 LXK2-PB12-K00, LXK2-PB12-L00, LXK2-PB12-M00, LXK2-PB14-N00, LXK2-PB14-P00, LXK2-PB14-Q00 LXK2-PR12-L00, LXK2-PR12-M00, LXK2-PR14-Q00, LXK2-PR14-R00 LXK2-PD12-Q00, LXK2-PD12-R00, LXK2-PD12-S00 LXK2-PH12-R00, LXK2-PH12-S00 LXK2-PL12-P00, LXK2-PL12-Q00, LXK2-PL12-R00 Source: www.luxeon.com KINGBRIGHT: KA-3528ASYC Source: www.kingbright.com
Q1 Q3 = mycrystals:CRYSTAL_SHIELDED
Q2 = mycrystals:CRYSTAL
R1-R60 = rcl:R-EU_: RESISTOR, European symbol
RN1 = mylcr:RN4
RN2-RN7 = mylcr:RN4-1
S1 = switch-dil:DIP04S: DIL/CODE SWITCH
SW1 = switches:PTS526-S
T1 = myfets:IRLML2402
X1 X2 = mycon:BU-SMA-V: FEMALE SMA CONNECTOR Radiall distributor RS 112-3794
XO1 = mycrystals:XO-SMD

## Net classes
1 100r: width 0.25 mm, clearance 0.3 mm to class 0, clearance 0.25 mm